# EAGLE design Parallel CS V4 (EAGLE 7.2.0)

## Sheet 1 of 2: Input Layer
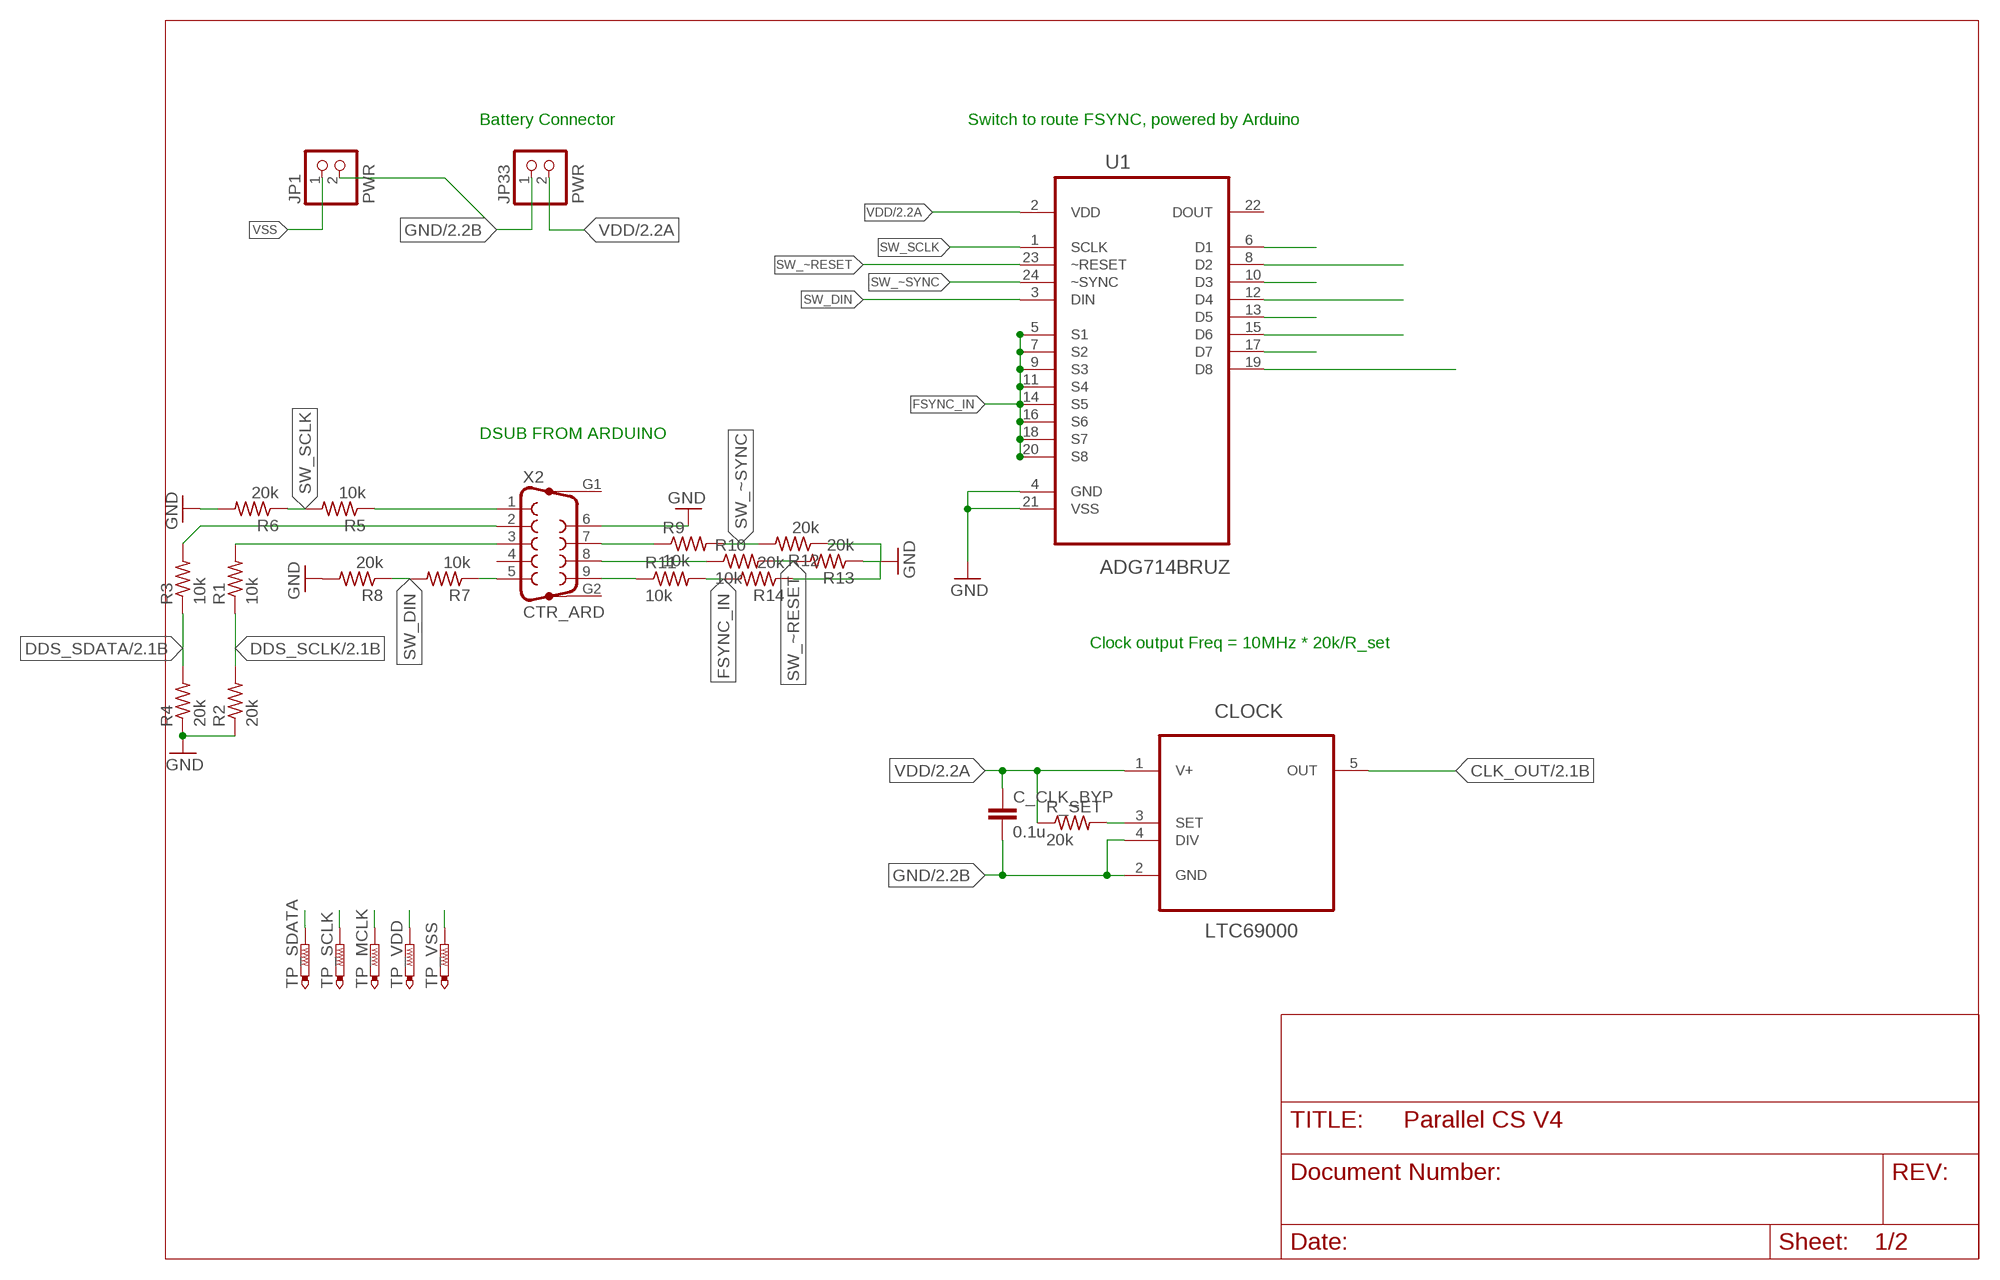
[diagram p0: schematic, sheet 1]

### Parts
C_CLK_BYP  0.1u  C-EUC0805  [C0805]
CLOCK  LTC69000  [SOT23-5L]
JP1  PWR  PINHD-1X2  [1X02]
JP33  PWR  PINHD-1X2  [1X02]
R1  10k  R-US_R0805  [R0805]
R2  20k  R-US_R0603  [R0603]
R3  10k  R-US_R0805  [R0805]
R4  20k  R-US_R0603  [R0603]
R5  10k  R-US_R0805  [R0805]
R6  20k  R-US_R0603  [R0603]
R7  10k  R-US_R0805  [R0805]
R8  20k  R-US_R0603  [R0603]
R9  10k  R-US_R0805  [R0805]
R10  10k  R-US_R0805  [R0805]
R11  10k  R-US_R0805  [R0805]
R12  20k  R-US_R0603  [R0603]
R13  20k  R-US_R0603  [R0603]
R14  20k  R-US_R0603  [R0603]
R_SET  20k  R-US_R0603  [R0603]
TP_MCLK  PTR1PAD1-13  [P1-13]
TP_SCLK  PTR1PAD1-13  [P1-13]
TP_SDATA  PTR1PAD1-13  [P1-13]
TP_VDD  PTR1PAD1-13  [P1-13]
TP_VSS  PTR1PAD1-13  [P1-13]
U1  ADG714BRUZ  [SOP65P640X120-24N]
X2  CTR_ARD  F09HP  [F09HP]

### Nets
CLK_OUT: CLOCK.5(OUT) TP_MCLK.TP ; also sheet 2
DDS_SCLK: R1.1 R2.2 TP_SCLK.TP ; also sheet 2
DDS_SCLK_5V: R1.2 X2.3
DDS_SDATA: R3.1 R4.2 TP_SDATA.TP ; also sheet 2
DDS_SDATA_5V: R3.2 X2.2
FSYNC_CS1: U1.6(D1)
FSYNC_CS2: U1.8(D2)
FSYNC_CS3: U1.10(D3)
FSYNC_CS4: U1.12(D4)
FSYNC_CS5: U1.13(D5)
FSYNC_CS6: U1.15(D6)
FSYNC_CS7: U1.17(D7)
FSYNC_CS8: U1.19(D8)
FSYNC_IN: R11.2 R14.2 U1.5(S1) U1.7(S2) U1.9(S3) U1.11(S4) U1.14(S5) U1.16(S6) U1.18(S7) U1.20(S8)
FSYNC_IN_5V: R11.1 X2.9
GND: C_CLK_BYP.2 CLOCK.2(GND) CLOCK.4(DIV) JP1.2 JP33.1 R2.1 R4.1 R6.2 R8.2 R12.1 R13.1 R14.1 U1.4(GND) U1.21(VSS) X2.6 ; also sheet 2
N$2: CLOCK.3(SET) R_SET.2
SW_DIN: R7.2 R8.1 U1.3(DIN)
SW_DIN_5V: R7.1 X2.5
SW_SCLK: R5.2 R6.1 U1.1(SCLK)
SW_SCLK_5V: R5.1 X2.1
SW_~RESET: R10.2 R13.2 U1.23(~RESET)
SW_~RESET_5V: R10.1 X2.8
SW_~SYNC: R9.2 R12.2 U1.24(~SYNC)
SW_~SYNC_5V: R9.1 X2.7
VDD: C_CLK_BYP.1 CLOCK.1(V+) JP33.2 R_SET.1 TP_VDD.TP U1.2(VDD) ; also sheet 2
VSS: JP1.1 TP_VSS.TP ; also sheet 2
Unconnected: U1.22(DOUT) X2.4 X2.G1 X2.G2

### Notes on the sheet
- Battery Connector | Switch to route FSYNC, powered by Arduino
- DSUB FROM ARDUINO
- Clock output Freq = 10MHz * 20k/R_set

## Sheet 2 of 2: Current Source Block
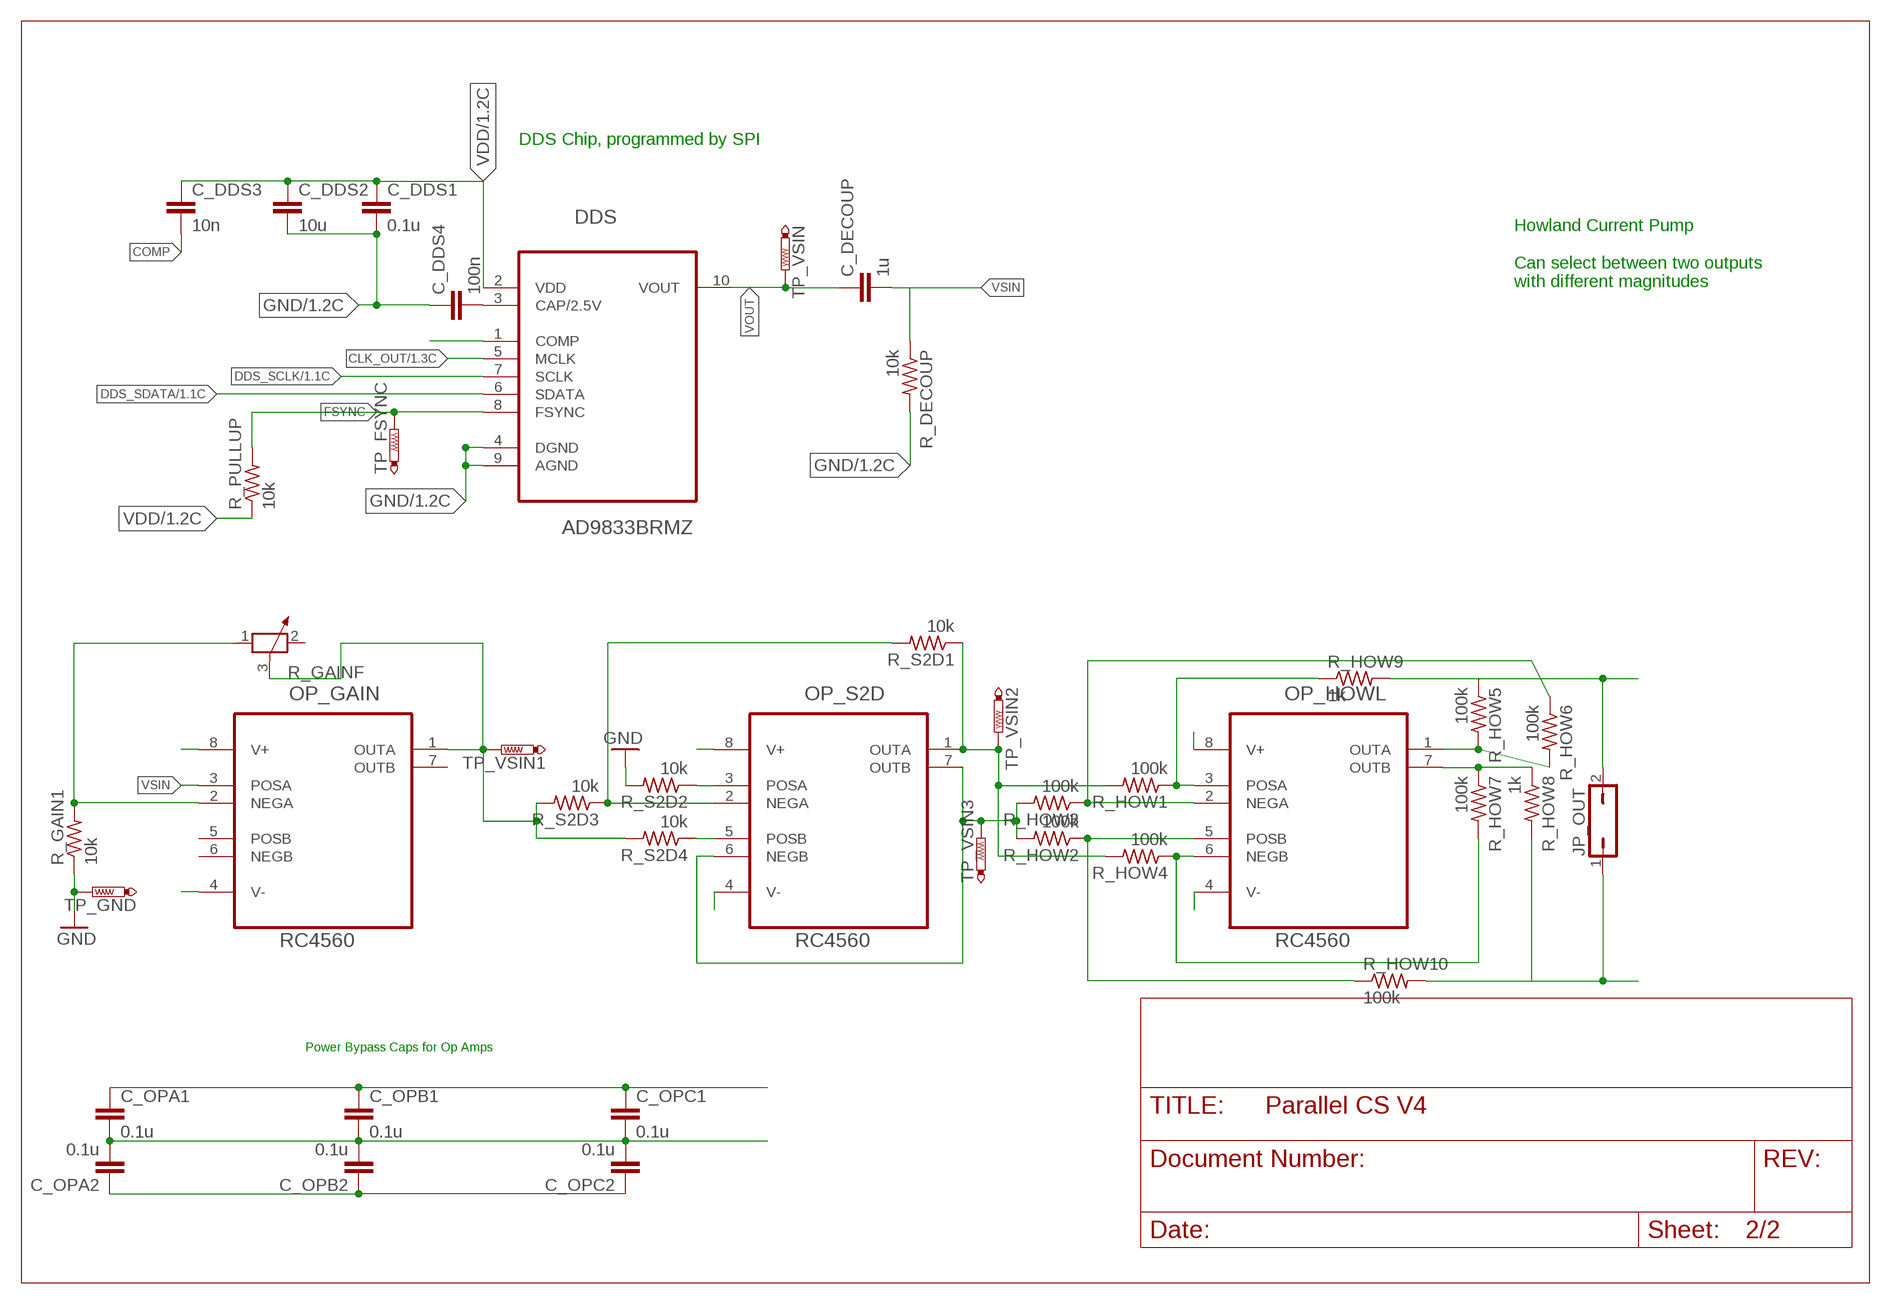
[diagram p1: schematic, sheet 2]

### Parts
C_DDS1  0.1u  C-EUC0805  [C0805]
C_DDS2  10u  C-EUC0805  [C0805]
C_DDS3  10n  C-EUC0805  [C0805]
C_DDS4  100n  C-EUC0805  [C0805]
C_DECOUP  1u  C-EUC0805  [C0805]
C_OPA1  0.1u  C-EUC0805  [C0805]
C_OPA2  0.1u  C-EUC0805  [C0805]
C_OPB1  0.1u  C-EUC0805  [C0805]
C_OPB2  0.1u  C-EUC0805  [C0805]
C_OPC1  0.1u  C-EUC0805  [C0805]
C_OPC2  0.1u  C-EUC0805  [C0805]
DDS  AD9833BRMZ  [SOP50P490X110-10N]
JP_OUT  JP1Q  [JP1]
OP_GAIN  RC4560  [DIL08]
OP_HOWL  RC4560  [DIL08]
OP_S2D  RC4560  [DIL08]
R_DECOUP  10k  R-US_R0805  [R0805]
R_GAIN1  10k  R-US_R0805  [R0805]
R_GAINF  POTENTIOMETER_PT-10  [PT-10]
R_HOW1  100k  R-US_R0805  [R0805]
R_HOW2  100k  R-US_R0805  [R0805]
R_HOW3  100k  R-US_R0805  [R0805]
R_HOW4  100k  R-US_R0805  [R0805]
R_HOW5  100k  R-US_R0805  [R0805]
R_HOW6  100k  R-US_R0805  [R0805]
R_HOW7  100k  R-US_R0805  [R0805]
R_HOW8  1k  R-US_R0805  [R0805]
R_HOW9  1k  R-US_R0805  [R0805]
R_HOW10  100k  R-US_R0805  [R0805]
R_PULLUP  10k  R-US_R0805  [R0805]
R_S2D1  10k  R-US_R0805  [R0805]
R_S2D2  10k  R-US_R0805  [R0805]
R_S2D3  10k  R-US_R0805  [R0805]
R_S2D4  10k  R-US_R0805  [R0805]
TP_FSYNC  PTR1PAD1-13  [P1-13]
TP_GND  PTR1PAD1-13  [P1-13]
TP_VSIN  PTR1PAD1-13  [P1-13]
TP_VSIN1  PTR1PAD1-13  [P1-13]
TP_VSIN2  PTR1PAD1-13  [P1-13]
TP_VSIN3  PTR1PAD1-13  [P1-13]

### Nets
CLK_OUT: DDS.5(MCLK) ; also sheet 1
COMP: C_DDS3.2 DDS.1(COMP)
DDS_SCLK: DDS.7(SCLK) ; also sheet 1
DDS_SDATA: DDS.6(SDATA) ; also sheet 1
FSYNC: DDS.8(FSYNC) R_PULLUP.2 TP_FSYNC.TP
GND: C_DDS1.2 C_DDS2.2 C_DDS4.1 C_OPA1.2 C_OPA2.2 C_OPB1.2 C_OPB2.2 C_OPC1.2 C_OPC2.2 DDS.4(DGND) DDS.9(AGND) R_DECOUP.2 R_GAIN1.1 R_S2D2.2 TP_GND.TP ; also sheet 1
N$1: C_DDS4.2 DDS.3(CAP/2.5V)
N$3: OP_GAIN.1(OUTA) R_GAINF.3 R_S2D3.2 R_S2D4.2 TP_VSIN1.TP
N$4: OP_S2D.6(NEGB) OP_S2D.7(OUTB) R_HOW2.2 R_HOW3.2 TP_VSIN3.TP
N$5: OP_GAIN.2(NEGA) R_GAIN1.2 R_GAINF.1
N$6: OP_S2D.5(POSB) R_S2D4.1
N$7: OP_HOWL.5(POSB) R_HOW2.1 R_HOW10.1
N$8: OP_S2D.1(OUTA) R_HOW1.2 R_HOW4.2 R_S2D1.1 TP_VSIN2.TP
N$9: OP_S2D.3(POSA) R_S2D2.1
N$10: OP_S2D.2(NEGA) R_S2D1.2 R_S2D3.1
N$11: OP_HOWL.3(POSA) R_HOW1.1 R_HOW9.1
N$12: OP_HOWL.2(NEGA) R_HOW3.1 R_HOW6.1
N$13: JP_OUT.2 R_HOW5.1 R_HOW9.2
N$14: JP_OUT.1 R_HOW8.2 R_HOW10.2
N$16: OP_HOWL.1(OUTA) R_HOW5.2 R_HOW6.2
N$17: OP_HOWL.7(OUTB) R_HOW7.1 R_HOW8.1
N$20: OP_HOWL.6(NEGB) R_HOW4.1 R_HOW7.2
VDD: C_DDS1.1 C_DDS2.1 C_DDS3.1 C_OPA1.1 C_OPB1.1 C_OPC1.1 DDS.2(VDD) OP_GAIN.8(V+) OP_HOWL.8(V+) OP_S2D.8(V+) R_PULLUP.1 ; also sheet 1
VOUT: C_DECOUP.1 DDS.10(VOUT) TP_VSIN.TP
VSIN: C_DECOUP.2 OP_GAIN.3(POSA) R_DECOUP.1
VSS: C_OPA2.1 C_OPB2.1 C_OPC2.1 OP_GAIN.4(V-) OP_HOWL.4(V-) OP_S2D.4(V-) ; also sheet 1
Unconnected: OP_GAIN.5(POSB) OP_GAIN.6(NEGB) OP_GAIN.7(OUTB) R_GAINF.2

### Notes on the sheet
- DDS Chip, programmed by SPI
- Howland Current Pump
  
  Can select between two outputs
  with different magnitudes
- Power Bypass Caps for Op Amps

## Library data of the parts
C_CLK_BYP C_DDS1-C_DDS4 C_DECOUP C_OPA1 C_OPA2 C_OPB1 C_OPB2 C_OPC1 C_OPC2 = resistor:C-EU: CAPACITOR, European symbol
CLOCK = LTC6900:LTC69000: Low Power, 1kHz to 20MHz Resistor Set SOT-23 Oscillator
DDS = ad9833:AD9833BRMZ: Low Power 12.65 mW, 2.3 V to 5.5 V,Low Power 12.65 mW, 2.3 V to 5.5 V,Low Power 12.65 mW, 2.3 V to 5.5 V,Programmable Waveform Generator; MPN: AD9833BRMZ; OC_FARNELL: 1581966; OC_NEWARK: 19M1014; PACKAGE: MSOP-10; SUPPLIER: Analog Devices
JP1 JP33 = pinhead:PINHD-1X2: PIN HEADER
JP_OUT = jumper:JP1Q: JUMPER
OP_GAIN OP_HOWL OP_S2D = RC4560:RC4560: RC4560 Op-Amp Texas Instruments
R1-R14 R_SET = resistor:R-US_: RESISTOR, American symbol
R_DECOUP R_GAIN1 R_HOW1-R_HOW10 R_PULLUP R_S2D1-R_S2D4 = rcl:R-US_: RESISTOR, American symbol
R_GAINF = rcl:POTENTIOMETER_: Potentiometer
TP_FSYNC TP_GND TP_MCLK TP_SCLK TP_SDATA TP_VDD TP_VSIN TP_VSIN1-TP_VSIN3 TP_VSS = testpad:PTR1: TEST PIN
U1 = SwitchBoard:ADG714BRUZ: CMOS, Low Voltage Serially Controlled, Octal SPST Switches; MPN: ADG714BRUZ; OC_FARNELL: 9604367; OC_NEWARK: 59K1531; PACKAGE: TSSOP-24; SUPPLIER: Analog Devices
X2 = con-subd:F09HP: SUB-D; OC_FARNELL: unknown; OC_NEWARK: unknown

## Board
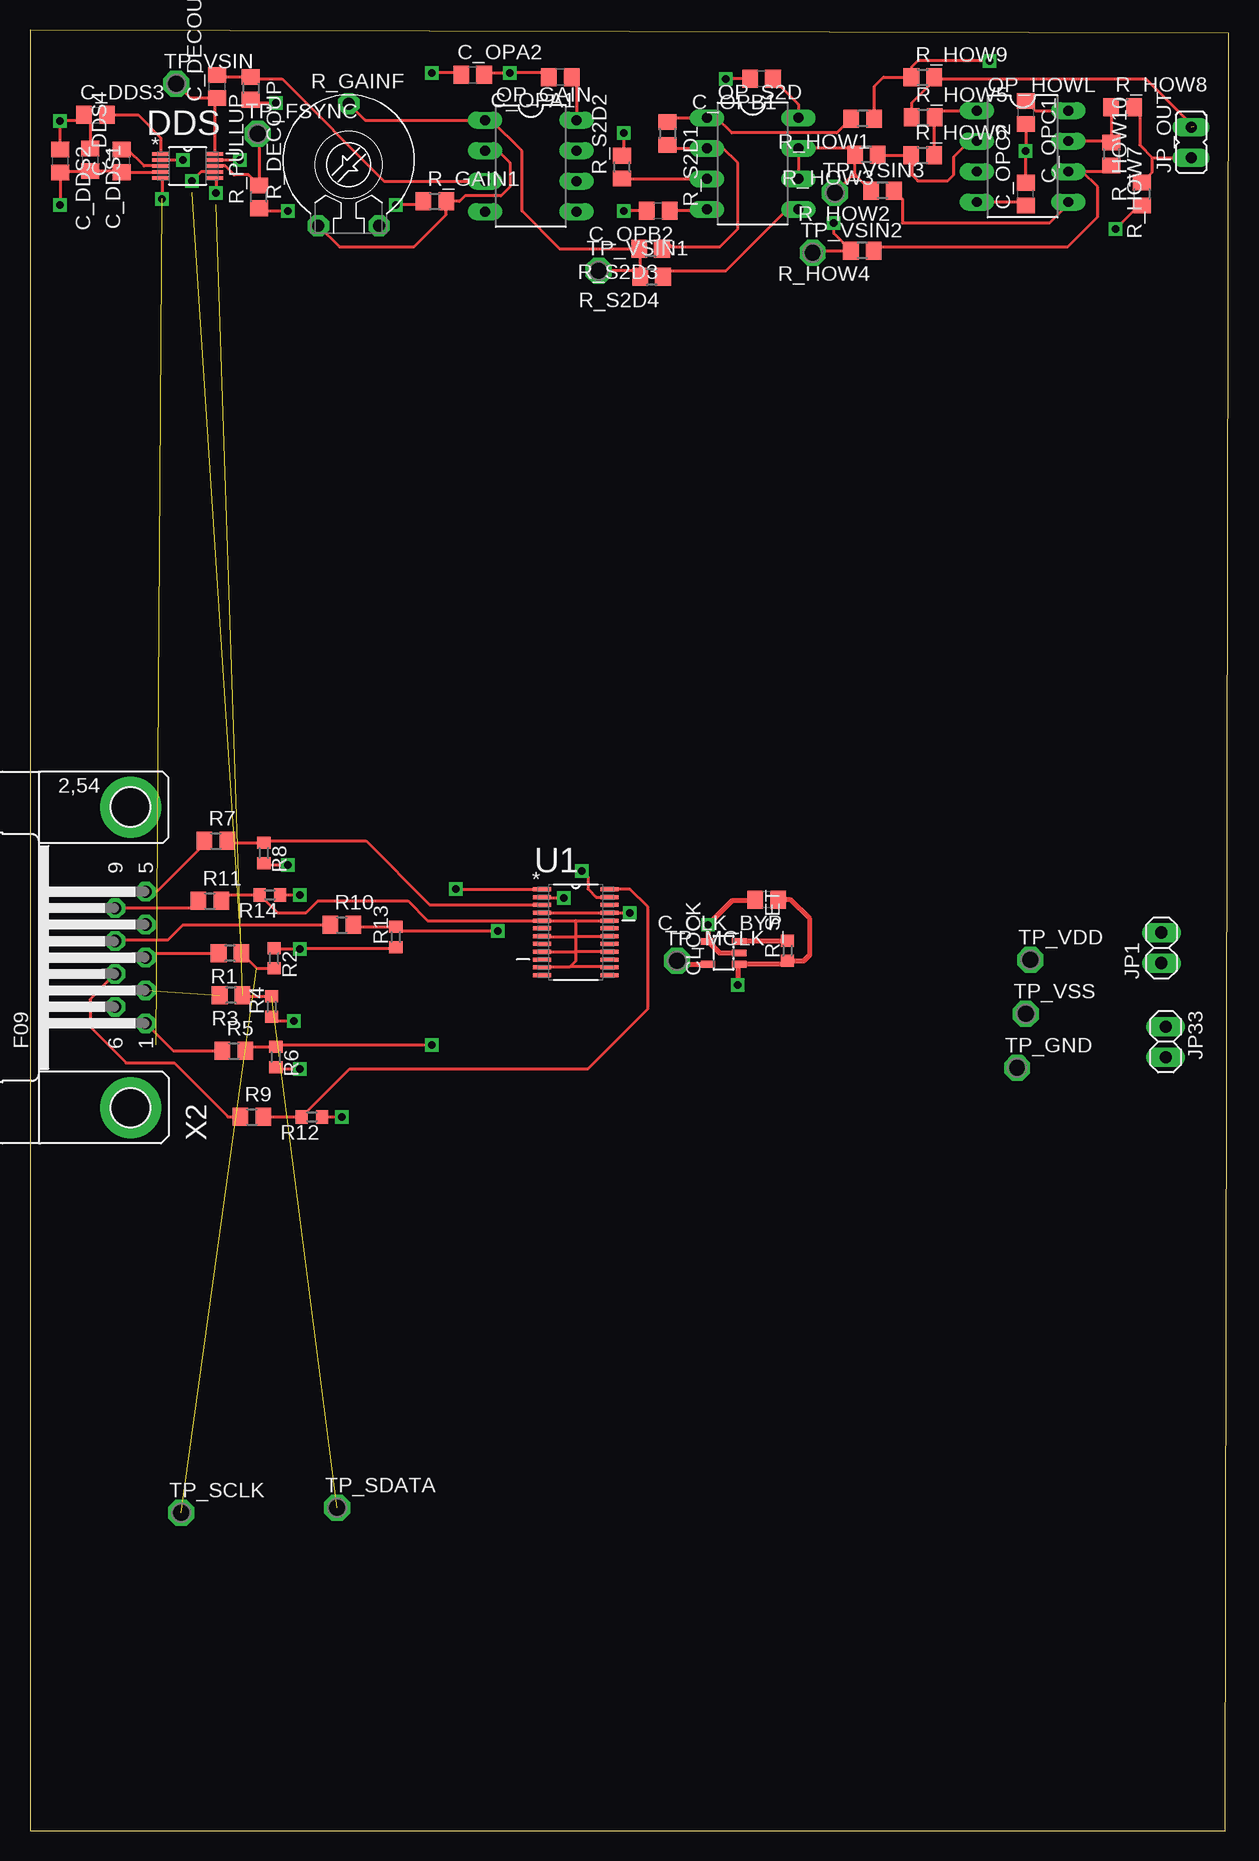
[diagram p2: board, top side]
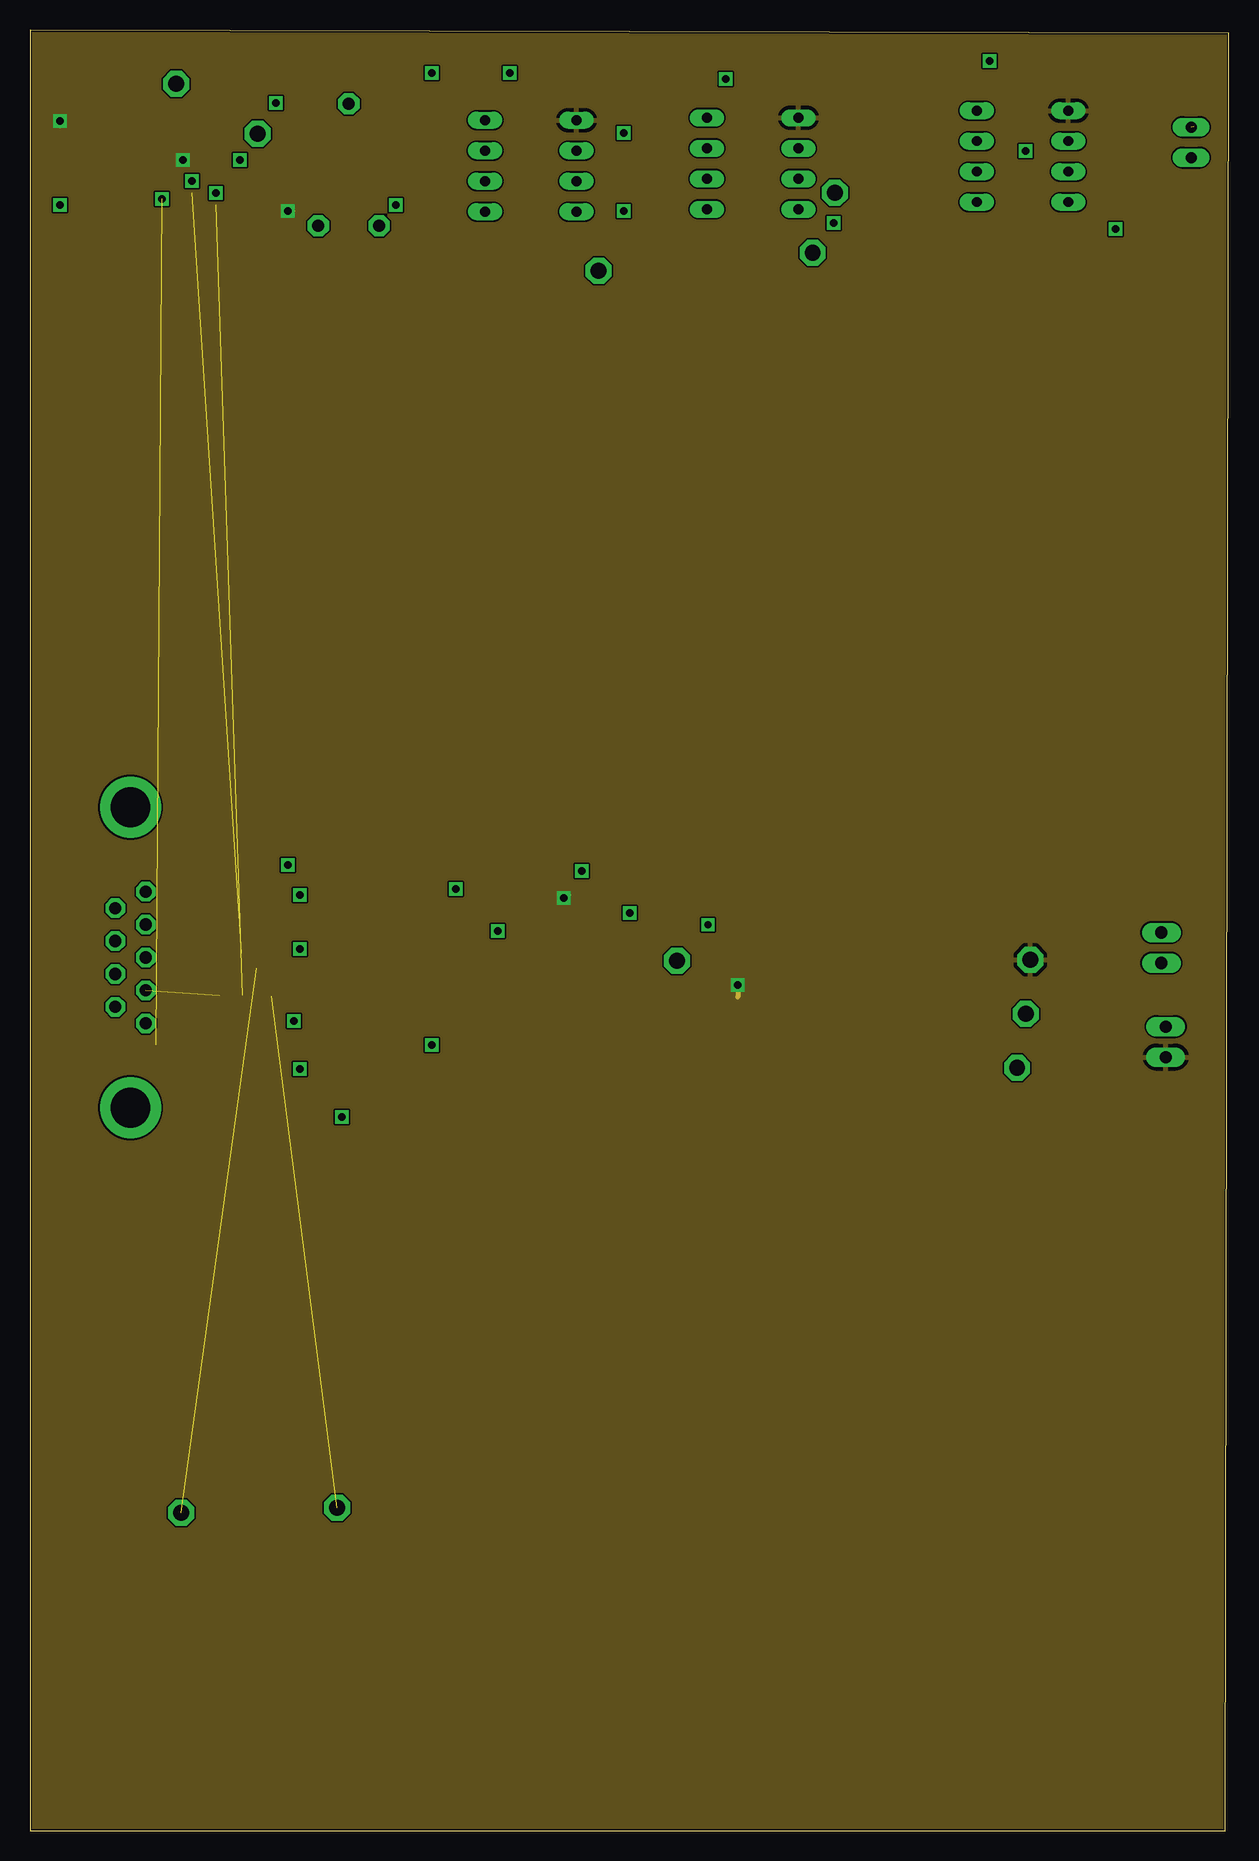
[diagram p3: board, inner layer VDD]
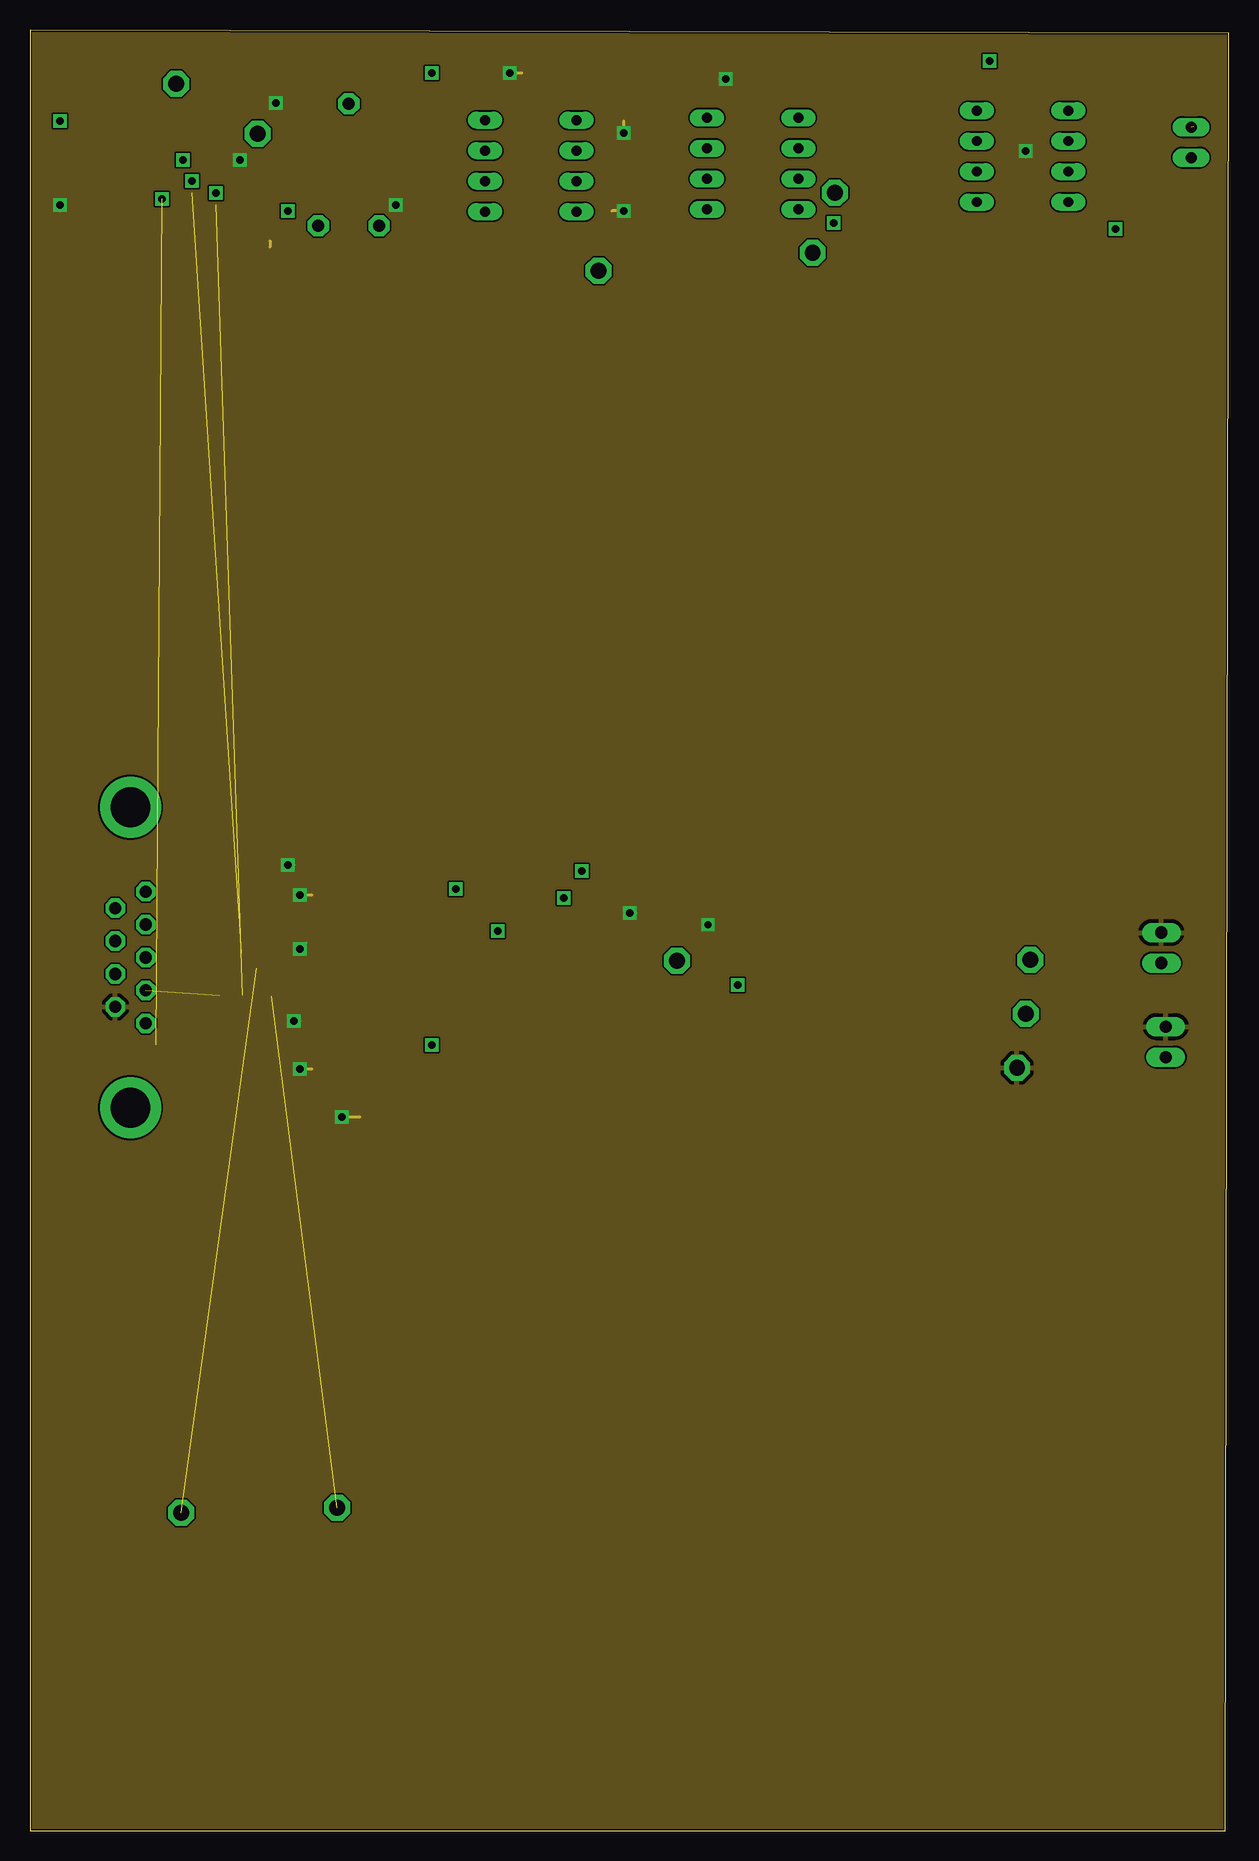
[diagram p4: board, inner layer GND]
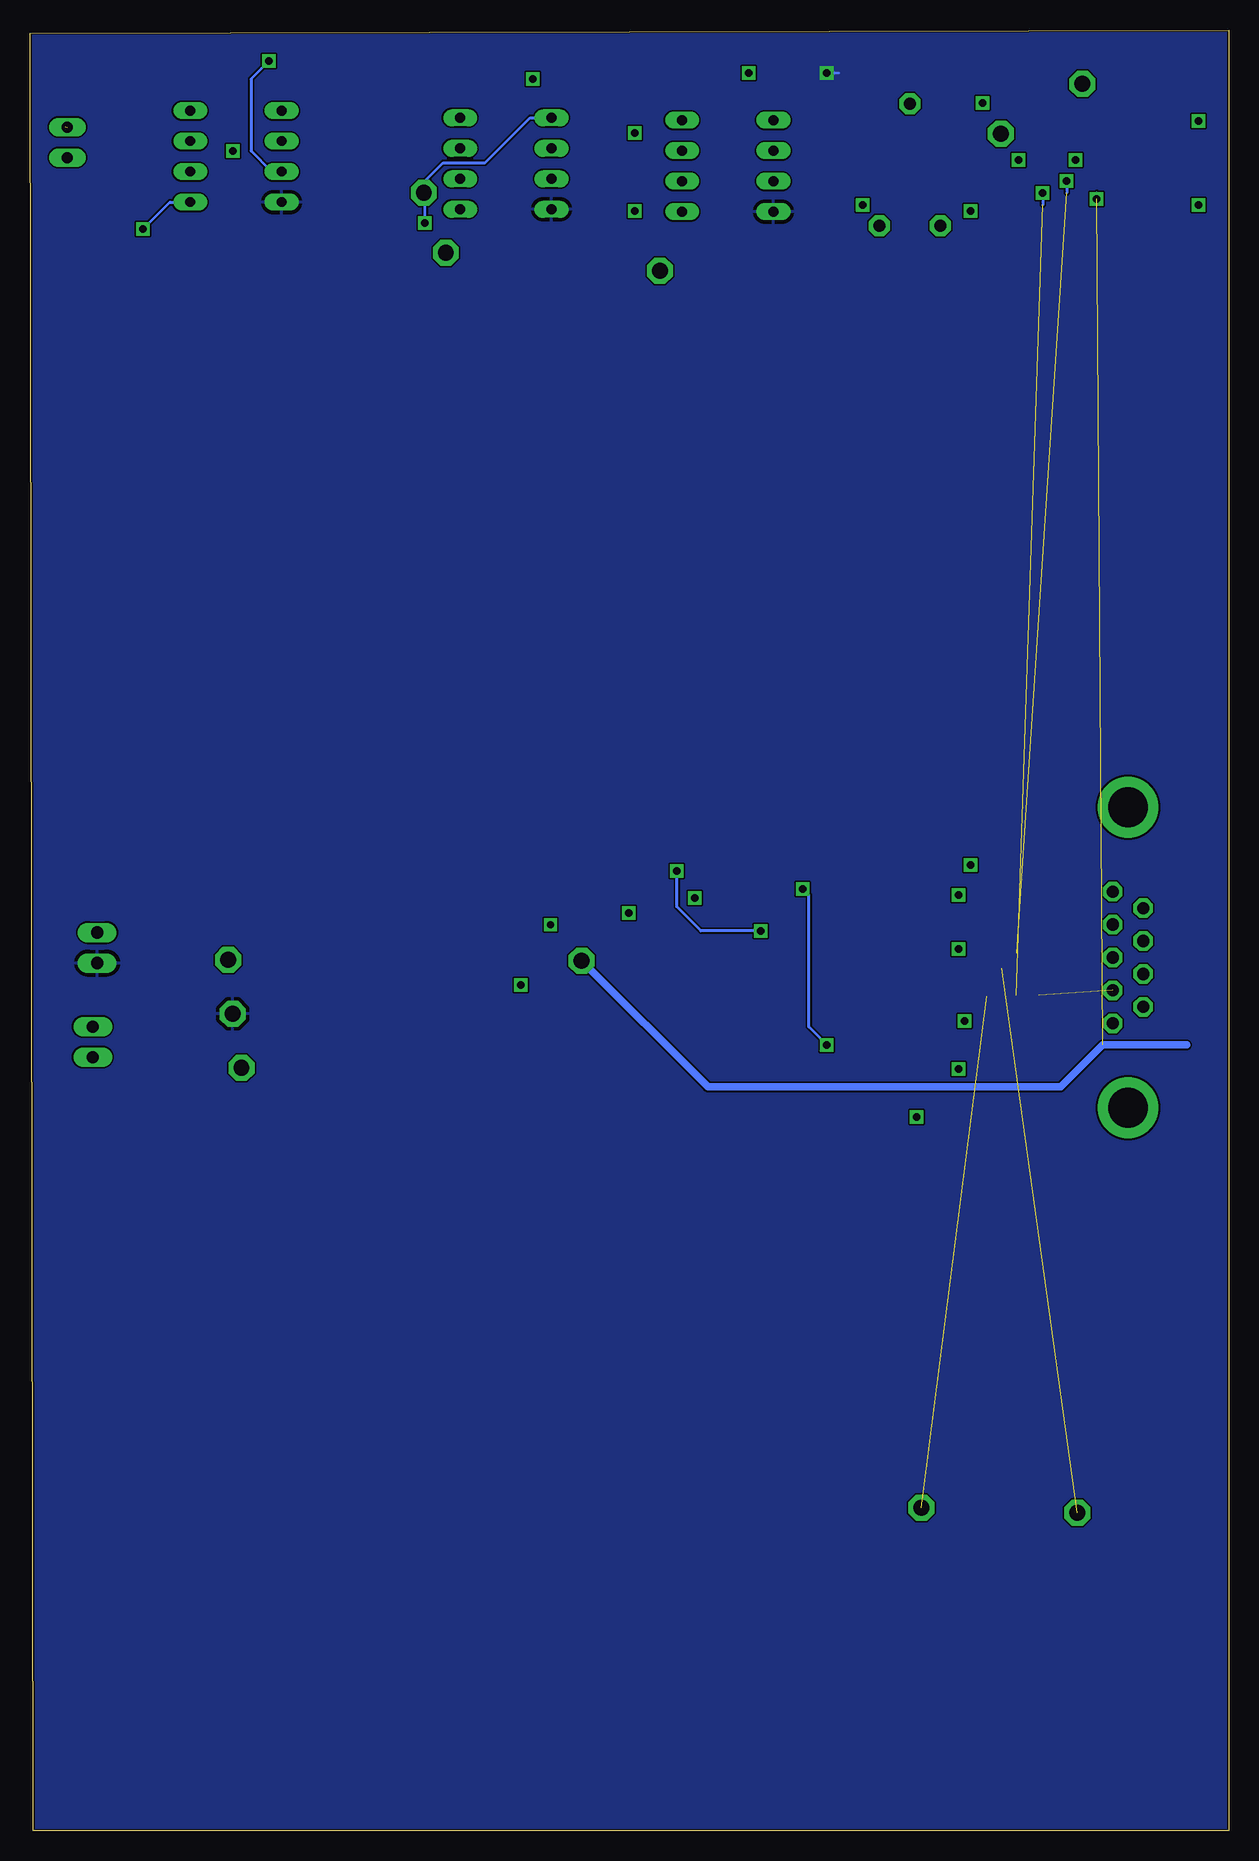
[diagram p5: board, bottom side, seen from below]

Size 99.92 x 150.08 mm. Coordinates in mm from the lower left corner, seen from the top.
Outline: 0,0 99.65,0 99.92,149.81 0,150.08 0,0
Copper layers (1*2*15*16): Top 0.035mm / dielectric 1.5mm / VDD 0.035mm / dielectric 0.15mm / GND 0.035mm / dielectric 0.2mm / Bottom 0.035mm
Design rules "SparkFun-4-layer": minimum track width 6mil, minimum drill 13mil, track to track 6mil, track to pad 6mil, pad to pad 6mil, via to via 6mil, smd to smd 6mil, copper to edge 6mil, drill to drill 8mil, minimum pad ring 12mil, minimum via ring 10mil, stop-mask expansion 4mil, vias tented up to drill 20mil, thermal gap 12mil

### Footprints (pad centres in the part's own frame; a part is rotated, then mirrored left to right if it is on the bottom)
C0805 = smd 1.3 x 1.5: 1 -0.95,0; 2 0.95,0
SOT23-5L = smd 0.55 x 1.2: 1 -0.95,-1.3; 2 0,-1.3; 3 0.95,-1.3; 4 0.95,1.3; 5 -0.95,1.3
SOP50P490X110-10N = smd 1.422 x 0.305: 1 -2.235,0.991; 2 -2.235,0.508; 3 -2.235,0; 4 -2.235,-0.508; 5 -2.235,-0.991; 6 2.235,-0.991; 7 2.235,-0.508; 8 2.235,0; 9 2.235,0.508; 10 2.235,0.991
1X02 = drill 1.016 long: 1 -1.27,0; 2 1.27,0
JP1 = drill 0.914 long: 1 0,-1.27; 2 0,1.27
DIL08 = drill 0.813 long: 1 -3.81,-3.81; 2 -1.27,-3.81; 3 1.27,-3.81; 4 3.81,-3.81; 5 3.81,3.81; 6 1.27,3.81; 7 -1.27,3.81; 8 -3.81,3.81
R0805 = smd 1.3 x 1.5: 1 -0.95,0; 2 0.95,0
R0603 = smd 1 x 1.1: 1 -0.85,0; 2 0.85,0
PT-10 = drill 1.016 pad 1.778 octagon: 1 -2.54,-5.08; 2 2.54,-5.08; 3 0,5.08
P1-13 = drill 1.321 pad 2.159 octagon: TP 0,0
SOP65P640X120-24N = smd 1.473 x 0.356: 1 -2.819,3.581; 2 -2.819,2.921; 3 -2.819,2.286; 4 -2.819,1.626; 5 -2.819,0.965; 6 -2.819,0.33; 7 -2.819,-0.33; 8 -2.819,-0.965; 9 -2.819,-1.626; 10 -2.819,-2.286; 11 -2.819,-2.921; 12 -2.819,-3.581; 13 2.819,-3.581; 14 2.819,-2.921; 15 2.819,-2.286; 16 2.819,-1.626; 17 2.819,-0.965; 18 2.819,-0.33; 19 2.819,0.33; 20 2.819,0.965; 21 2.819,1.626; 22 2.819,2.286; 23 2.819,2.921; 24 2.819,3.581
F09HP = drill 1.016 octagon: 1 -5.486,-1.27; 2 -2.743,-1.27; 3 0,-1.27; 4 2.743,-1.27; 5 5.486,-1.27; 6 -4.115,1.27; 7 -1.372,1.27; 8 1.372,1.27; 9 4.115,1.27 | drill 3.302 pad 5.08: G1 -12.522,0; G2 12.522,0

### Placement (x,y rotation side)
C_CLK_BYP  61.42,77.59 180 top
C_DDS1  5,139.27 270 top
C_DDS2  2.5,139.16 270 top
C_DDS3  5.45,143 0 top
C_DDS4  7.65,139.18 90 top
C_DECOUP  15.59,145.38 90 top
C_OPA1  44.21,146.15 180 top
C_OPA2  36.9,146.35 0 top
C_OPB1  60.99,146 180 top
C_OPB2  52.38,135 180 top
C_OPC1  83,143.21 270 top
C_OPC2  83,136.4 90 top
CLOCK  57.82,73.18 90 top
DDS  13.15,138.75 0 top
JP1  94.32,73.6 90 top
JP33  94.68,65.75 270 top
JP_OUT  96.8,140.71 0 top
OP_GAIN  41.75,138.75 270 top
OP_HOWL  82.75,139.55 270 top
OP_S2D  60.25,138.95 270 top
R1  16.68,73.15 180 top
R2  20.35,72.73 270 top
R3  16.76,69.65 180 top
R4  20.15,68.69 90 top
R5  17,65 0 top
R6  20.5,64.5 270 top
R7  15.5,82.5 0 top
R8  19.5,81.5 270 top
R9  18.5,59.5 0 top
R10  26,75.5 0 top
R11  15,77.5 0 top
R12  23.5,59.5 180 top
R13  30.5,74.5 90 top
R14  20,78 180 top
R_DECOUP  18.41,145.22 270 top
R_GAIN1  33.75,135.8 0 top
R_GAINF  26.57,138.85 0 top
R_HOW1  69.41,142.7 180 top
R_HOW2  71.07,136.7 180 top
R_HOW3  69.73,139.7 180 top
R_HOW4  69.39,131.7 180 top
R_HOW5  74.45,142.8 0 top
R_HOW6  74.41,139.65 0 top
R_HOW7  90.15,139.75 270 top
R_HOW8  91.09,143.65 0 top
R_HOW9  74.43,146.15 0 top
R_HOW10  92.7,136.41 90 top
R_PULLUP  19.09,136.18 90 top
R_S2D1  53.15,141.46 270 top
R_S2D2  49.35,138.65 90 top
R_S2D3  51.74,131.85 180 top
R_S2D4  51.82,129.5 180 top
R_SET  63.15,73.35 90 top
TP_FSYNC  18.97,141.43 0 top
TP_GND  82.29,63.59 0 top
TP_MCLK  53.93,72.51 0 top
TP_SCLK  12.61,26.51 0 top
TP_SDATA  25.61,26.93 0 top
TP_VDD  83.4,72.59 0 top
TP_VSIN  12.18,145.59 0 top
TP_VSIN1  47.41,130.01 0 top
TP_VSIN2  65.25,131.51 0 top
TP_VSIN3  67.09,136.51 0 top
TP_VSS  83.01,68.09 0 top
U1  45.5,74.89 0 top
X2  8.38,72.79 90 top

### Tracks (layer width: path | path; a pad name or v marks a point on that pad's centre or on a via)
CLK_OUT  (via drill 0.6)  (1 unrouted)
  Top 0.254: DDS.5 11,137.67 v11,136
  Top 0.406: TP_MCLK.TP 54.21,72.23 CLOCK.5
  Bottom 0.254: v11,136 11,136.5
  Bottom 0.61: TP_MCLK.TP 43.42,62 14,62 10.5,65.5 3.5,65.5
COMP
  Top 0.254: C_DDS3.2 9,143 10.91,141.09 DDS.1
DDS_SCLK  (via drill 0.6)  (2 unrouted)
  Top 0.254: R1.1 18.9,71.88 R2.2 | DDS.7 15.38,138.25 14.25,138.25 v13.5,137.5
  Bottom 0.254: v13.5,137.5 13.5,136.5
DDS_SCLK_5V
  Top 0.254: X2.3 10.01,73.15 R1.2
DDS_SDATA  (via drill 0.6)  (2 unrouted)
  Top 0.254: R3.1 17.82,69.54 R4.2 | DDS.6 15.5,137.65 v15.5,136.5
  Bottom 0.254: v15.5,136.5 15.5,135.5
DDS_SDATA_5V  (1 unrouted)
FSYNC
  Top 0.254: DDS.8 16.25,138.75 17,138 18.22,138 R_PULLUP.2 19.09,141.31 TP_FSYNC.TP
FSYNC_IN
  Top 0.254: R11.2 16.45,78 R14.2 20.65,76.5 23,76.5 24,77.5 31.5,77.5 33.15,75.86 U1.5 45.5,75.86 | 45.5,75.86 U1.20 | U1.11 42.71,72 45,72 | 45,72 45.5,72.5 45.5,73.25 | 45.5,73.25 45.5,74.5 | 45.5,74.5 45.5,75.86 | U1.9 42.7,73.25 45.5,73.25 | U1.7 42.74,74.5 45.5,74.5 | U1.14 48.29,72 45,72 | U1.16 48.3,73.25 45.5,73.25 | U1.18 48.26,74.5 45.5,74.5
FSYNC_IN_5V
  Top 0.254: R11.1 13.46,76.91 X2.9
GND  (via drill 0.6)
  Top 0.254: v2.5,135.5 C_DDS2.2 2.61,138.32 C_DDS1.2 7.56,138.32 C_DDS4.1 7.66,138.24 DDS.4 | C_OPA2.2 38,146.5 v40,146.5 42.91,146.5 C_OPA1.2 | R_GAIN1.1 32.5,135.5 v30.5,135.5 | C_OPB2.2 v49.5,135 | R_S2D2.2 49.5,139.75 v49.5,141.5 | C_OPB1.2 v58,146 | R_DECOUP.2 18.68,144 v20.5,144 | DDS.9 v17.5,139.25 | C_OPC1.2 v83,140 C_OPC2.2 | R14.1 v22.5,78 | R12.1 v26,59.5 | R6.2 20.65,63.5 v22.5,63.5 | R8.2 19.65,80.5 v21.5,80.5 | R2.1 20.43,73.5 v22.5,73.5 30.35,73.5 R13.1 | R4.1 20.49,67.5 v22,67.5 | v50,76.5 48.34,76.5 U1.21 U1.4
  Top 0.406: C_CLK_BYP.2 60.38,77.5 58.5,77.5 v56.52,75.52 CLOCK.4 57.47,73.18 CLOCK.2
  GND 0.254: v2.5,135.5 2.5,135 | 20,132.5 20,132 | v40,146.5 41,146.5 | v30.5,135.5 30,135.5 | v49.5,135 48.5,135 | v49.5,141.5 49.5,142.5 | v58,146 57.5,146 | v17.5,139.25 17.25,139.5 17.5,139.5 | v83,140 83,139.5 | v22.5,78 23.5,78 | v26,59.5 27.5,59.5 | v22.5,63.5 23.5,63.5 | v21.5,80.5 22,80.5 | v22.5,73.5 23,74 | v22,67.5 22.5,67.5 | v50,76.5 50.5,76.5
  GND 0.406: v56.52,75.52 56.5,75.5
  pour GND: 105,153 105,150 105,-5 -9,-5 -11,-5 -11,153 -1,153
N$1
  Top 0.254: DDS.3 9.5,138.75 8.12,140.13 C_DDS4.2
N$2
  Top 0.406: R_SET.2 63.08,74.13 CLOCK.3
N$3
  Top 0.254: R_GAINF.3 27.94,142.56 OP_GAIN.1 38.44,142.56 41,140 41,135 44.15,131.85 R_S2D3.2 50.87,131.77 R_S2D4.2 50.36,130.01 TP_VSIN1.TP
N$4
  Top 0.254: OP_S2D.6 OP_S2D.7 68.26,140.22 R_HOW3.2 | R_HOW3.2 68.62,139.54 | R_HOW2.2 68.91,137.91 | 68.91,137.91 68.78,138.04 R_HOW3.2 | TP_VSIN3.TP 68.49,137.91 68.91,137.91
N$5
  Top 0.254: R_GAIN1.2 34.92,136.02 | R_GAINF.1 25.8,132 32,132 34.7,134.7 R_GAIN1.2 | OP_GAIN.2 37.96,140 39,140 40,139 40,137 39.25,136.25 36.25,136.25 35.8,135.8 R_GAIN1.2
N$6
  Top 0.254: R_S2D4.1 53.27,130 58,130 63.14,135.14 OP_S2D.5
N$7  (via drill 0.6)
  Top 0.254: OP_HOWL.5 86.56,135.56 85,134 72.72,134 72.72,136 R_HOW2.1 | 92.66,135.5 R_HOW10.1 92.46,135.46 v90.5,133.5
  Bottom 0.254: v90.5,133.5 88.26,135.74 OP_HOWL.5
N$8  (via drill 0.6)
  Top 0.254: R_S2D1.1 53.5,142.76 OP_S2D.1 57.24,142.76 58.5,141.5 67.26,141.5 R_HOW1.2 | v67,134 67,133.14 R_HOW4.2 65.44,131.7 TP_VSIN2.TP
  Bottom 0.254: v67,134 67,137.5 65.5,139 62,139 58.24,142.76 OP_S2D.1
N$9
  Top 0.254: R_S2D2.1 49.37,137.68 OP_S2D.3
N$10
  Top 0.254: R_S2D1.2 53.44,140.22 OP_S2D.2 57.78,140.22 59,139 59,133.5 57.5,132 53.46,132 53.15,132.31 R_S2D3.1
N$11  (via drill 0.6)
  Top 0.254: R_HOW1.1 70.36,145.36 71.15,146.15 R_HOW9.1 73.48,146.98 74,147.5 v80,147.5
  Bottom 0.254: v80,147.5 81.5,146 81.5,140 79.78,138.28 OP_HOWL.3
N$12
  Top 0.254: R_HOW3.1 70.73,139.65 R_HOW6.1 73.5,139.61 73.5,138 74,137.5 76.5,137.5 77,138 77,139.5 78.32,140.82 OP_HOWL.2
N$13  (1 unrouted)
  Top 0.254: R_HOW5.1 73.5,144 75.38,145.88 R_HOW9.2 75.53,146 93,146 97,142 97,141.5 | 96.52,141.98 JP_OUT.2
N$14
  Top 0.254: R_HOW8.2 92.5,143.19 92.5,140.5 93.56,139.44 | 93.56,139.44 JP_OUT.1 | R_HOW10.2 93.56,138.22 93.56,139.44
N$16
  Top 0.254: OP_HOWL.1 75.96,143.36 R_HOW5.2 75.4,139.69 R_HOW6.2
N$17
  Top 0.254: OP_HOWL.7 90.03,140.82 R_HOW7.1 R_HOW8.1
N$20
  Top 0.254: R_HOW4.1 70.64,132 86.5,132 89,134.5 89,137 87.72,138.28 | 87.72,138.28 87.5,138.28 OP_HOWL.6 | R_HOW7.2 89.63,138.28 87.72,138.28
SW_DIN
  Top 0.254: R7.2 16.6,82.35 R8.1 19.65,82.5 28,82.5 33.32,77.18 U1.3
SW_DIN_5V
  Top 0.254: R7.1 14.55,82.28 10.55,78.28 X2.5
SW_SCLK  (via drill 0.6)
  Top 0.254: R5.2 18.3,65.35 R6.1 20.65,65.5 v33.5,65.5 | v35.5,78.5 35.53,78.47 U1.1
  Bottom 0.254: v33.5,65.5 35,67 35,78 v35.5,78.5
SW_SCLK_5V
  Top 0.254: X2.1 11.95,65 R5.1
SW_~RESET  (via drill 0.6)
  Top 0.254: R10.2 27.1,75.35 R13.2 30.85,75 v39,75 | v46,80 46.5,79.5 46.5,78.5 47.19,77.81 U1.23
  Bottom 0.254: v39,75 44,75 46,77 v46,80
SW_~RESET_5V
  Top 0.254: X2.8 7.2,74.25 11.5,74.25 12.75,75.5 R10.1
SW_~SYNC
  Top 0.254: R9.2 R12.2 26.65,63.5 46.5,63.5 51.5,68.5 51.5,77 50.03,78.47 U1.24
SW_~SYNC_5V
  Top 0.254: X2.7 5,69.31 5,67 8,64 12,64 16.5,59.5 R9.1
VDD  (via drill 0.6)
  Top 0.254: C_OPA1.1 45.56,145.75 OP_GAIN.8 | C_OPB1.1 64.06,143.88 OP_S2D.8 | C_OPC1.1 83.8,143.36 OP_HOWL.8 | DDS.2 10.92,139.25 v12.75,139.25 | R_PULLUP.1 19.32,135 v21.5,135 | C_DDS1.1 5,142.5 C_DDS3.1 4,142.5 v2.5,142.5 C_DDS2.1 | U1.2 42.74,77.75 v44.5,77.75
  Top 0.406: C_CLK_BYP.1 63.41,77.59 65,76 65,73 64.5,72.5 R_SET.1 62.88,72.23 CLOCK.1 59,72.11 v59,70.5
  VDD 0.254: v12.75,139.25 12.5,139 13,139 | v21.5,135 22,135 | v2.5,142.5 2.5,142 | v44.5,77.75 44.75,78 45,78
  VDD 0.406: v59,70.5 59,69.5
  pour VDD: -4,154 110,154 110,153 110,-31 -9,-31 -9,-27 -9,154
VOUT
  Top 0.254: DDS.10 15.38,144.22 C_DECOUP.1 13.34,144.43 TP_VSIN.TP
VSIN
  Top 0.254: C_DECOUP.2 15.75,146.17 R_DECOUP.1 18.58,146 21,146 29.52,137.48 OP_GAIN.3
VSS  (via drill 0.6)
  Top 0.254: OP_S2D.4 56.3,135 C_OPB2.1 | C_OPC2.1 82.71,135.74 OP_HOWL.4 | C_OPA2.1 35.8,146.5 v33.5,146.5
  Bottom 0.254: v33.5,146.5 32.5,146.5
  pour Bottom: -11,156 -9,154 110.5,154 107,150.5 107,-10.5 104,-7.5 -13,-7.5 -11.5,-6 -11.5,150 -11,150.5